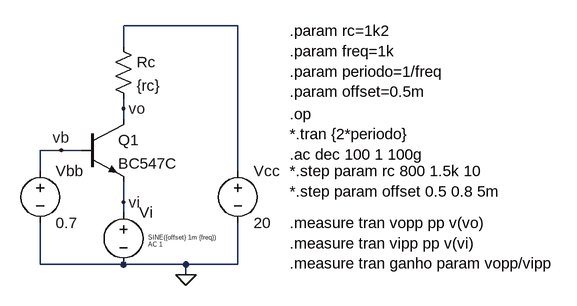
[diagram p0: schematic common_base_npn_ex1.asc]
common_base_npn_ex1.asc, the LTspice schematic file:
Version 4
SHEET 1 960 680
WIRE 352 -32 176 -32
WIRE 176 0 176 -32
WIRE 176 96 176 80
WIRE 176 112 176 96
WIRE 80 160 48 160
WIRE 112 160 80 160
WIRE 48 192 48 160
WIRE 352 192 352 -32
WIRE 176 240 176 208
WIRE 176 256 176 240
WIRE 48 336 48 272
WIRE 176 336 48 336
WIRE 272 336 176 336
WIRE 352 336 352 272
WIRE 352 336 272 336
WIRE 272 352 272 336
FLAG 272 352 0
FLAG 176 96 vo
FLAG 176 240 vi
FLAG 80 160 vb
SYMBOL npn 112 112 R0
SYMATTR InstName Q1
SYMATTR Value BC547C
SYMBOL voltage 176 240 R0
WINDOW 3 38 54 Left 0
WINDOW 123 38 65 Left 0
WINDOW 39 0 0 Left 0
SYMATTR Value SINE({offset} 1m {freq})
SYMATTR Value2 AC 1
SYMATTR InstName Vi
SYMBOL res 160 -16 R0
SYMATTR InstName Rc
SYMATTR Value {rc}
SYMBOL voltage 352 176 R0
WINDOW 123 0 0 Left 0
WINDOW 39 0 0 Left 0
SYMATTR InstName Vcc
SYMATTR Value 20
SYMBOL voltage 48 176 R0
WINDOW 123 0 0 Left 0
WINDOW 39 0 0 Left 0
SYMATTR InstName Vbb
SYMATTR Value 0.7
TEXT 432 -24 Left 2 !.param rc=1k2\n.param freq=1k\n.param periodo=1/freq\n.param offset=0.5m
TEXT 432 104 Left 2 !.op\n*.tran {2*periodo}\n.ac dec 100 1 100g
TEXT 432 272 Left 2 !.measure tran vopp pp v(vo)\n.measure tran vipp pp v(vi)\n.measure tran ganho param vopp/vipp
TEXT 432 192 Left 2 !*.step param rc 800 1.5k 10\n*.step param offset 0.5 0.8 5m

The netlist it stands for:
* common_base_npn_ex1.asc
Q1 vo vb vi 0 BC547C
Vi vi 0 SINE({offset} 1m {freq}) AC 1
Rc N001 vo {rc}
Vcc N001 0 20
Vbb vb 0 0.7
.model NPN NPN
.model PNP PNP
.lib standard.bjt
.param rc=1k2
.param freq=1k
.param periodo=1/freq
.param offset=0.5m
.op
*.tran {2*periodo}
.ac dec 100 1 100g
.measure tran vopp pp v(vo)
.measure tran vipp pp v(vi)
.measure tran ganho param vopp/vipp
*.step param rc 800 1.5k 10
*.step param offset 0.5 0.8 5m
.backanno
.end